# EAGLE design ESP_Testing_Adapter (EAGLE 8.6.0)
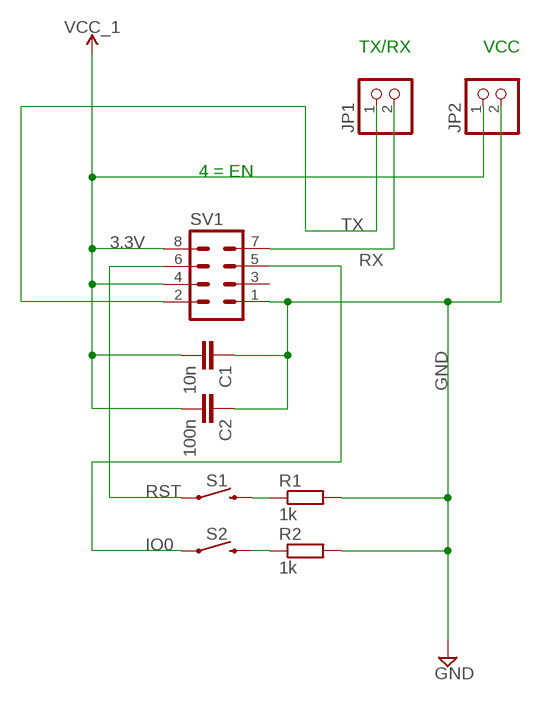
[diagram p0: schematic, sheet 1]

## Parts
C1  10n  C2.5/4  [C2.5-4]
C2  100n  C2.5/4  [C2.5-4]
JP1  PINHD-1X2  [1X02]
JP2  PINHD-1X2  [1X02]
R1  1k  R-EU_0207/7  [0207/7]
R2  1k  R-EU_0207/7  [0207/7]
S1  MOMENTARY-SWITCH-SPST-PTH-6.0MM  [TACTILE_SWITCH_PTH_6.0MM]
S2  MOMENTARY-SWITCH-SPST-PTH-6.0MM  [TACTILE_SWITCH_PTH_6.0MM]
SV1  MA04-2  [MA04-2]

## Nets
3.3V: C1.2 C2.2 JP2.1 SV1.4 SV1.8 ; supply symbol labelled VCC_1
GND: C1.1 C2.1 JP2.2 R1.2 R2.2 SV1.1
IO0: S2.1 SV1.5
N$1: R1.1 S1.3
N$3: R2.1 S2.3
RST: S1.1 SV1.6
RX: JP1.2 SV1.7
TX: JP1.1 SV1.2
Unconnected: SV1.3

## Notes on the sheet
- TX/RX | VCC
- 4 = EN

## Library data of the parts
C1 C2 = capacitor-wima:C: CAPACITOR naming: grid - package width
JP1 JP2 = pinhead:PINHD-1X2: PIN HEADER
R1 R2 = rcl:R-EU_: RESISTOR, European symbol; SPICEPREFIX: R
S1 S2 = SparkFun-Switches:MOMENTARY-SWITCH-SPST: Momentary Switch (Pushbutton) - SPST Normally-open (NO) SPST momentary switches (buttons, pushbuttons). Variants PTH-12MM - 12mm square, through-hole Momentary Pushbutton Switch - 12mm Square <https://www.sparkfun.com/products/9190> (COM-09190) PTH-6.0MM, PTH-6.0MM-KIT - 6.0mm square, through-hole Mini Pushbutton Switch <https://www.sparkfun.com/products/97> (COM-00097) KIT package intended for soldering kit's - only one side of pads' copper is exposed. PTH-RIGHT-ANGLE-KIT - Right-angle, through-hole Right Angle Tactile Button <https://www.sparkfun.com/products/10791> - Used on SparkFun BigTime Watch Kit <https://www.sparkfun.com/products/11734> SMD-12MM - 12mm square, surface-mount Tactile Button - SMD (12mm) <https://www.sparkfun.com/products/12993> (COM-12993) Used on SparkFun PicoBoard <https://www.sparkfun.com/products/11888> SMD-4.5MM - 4.5mm Square Trackball Switch Used on SparkFun Blackberry Trackballer Breakout <https://www.sparkfun.com/products/13169> SMD-4.6MMX2.8MM - 4.60mm x 2.80mm, surface mount Used on SparkFun SAMD21 Mini Breakout <https://www.sparkfun.com/products/13664> SMD-5.2MM, SMD-5.2-REDUNDANT - 5.2mm square, surface-mount Mini Pushbutton Switch - SMD <https://www.sparkfun.com/products/8720> (COM-08720) Used on Arduino Pro Mini <https://www.sparkfun.com/products/11114> REDUNDANT package connects both switch circuits together SMD-6.0X3.5MM - 6.0 x 3.5mm, surface mount Momentary Reset Switch SMD <https://www.sparkfun.com/products/8229> (COM-08229) SMD-6.2MM-TALL - 6.2mm square, surface mount Tactile Button - SMD (6mm) <https://www.sparkfun.com/products/12992> Used on SparkFun Digital Sandbox <https://www.sparkfun.com/products/12651> SMD-RIGHT-ANGLE - Right-angle, surface mount Used on SparkFun Block for Intel® Edison - Arduino <https://www.sparkfun.com/products/13036>; PROD_ID: SWCH-08441; SF_SKU: COM-00097
SV1 = con-lstb:MA04-2: PIN HEADER; OC_FARNELL: unknown; OC_NEWARK: unknown

## Board
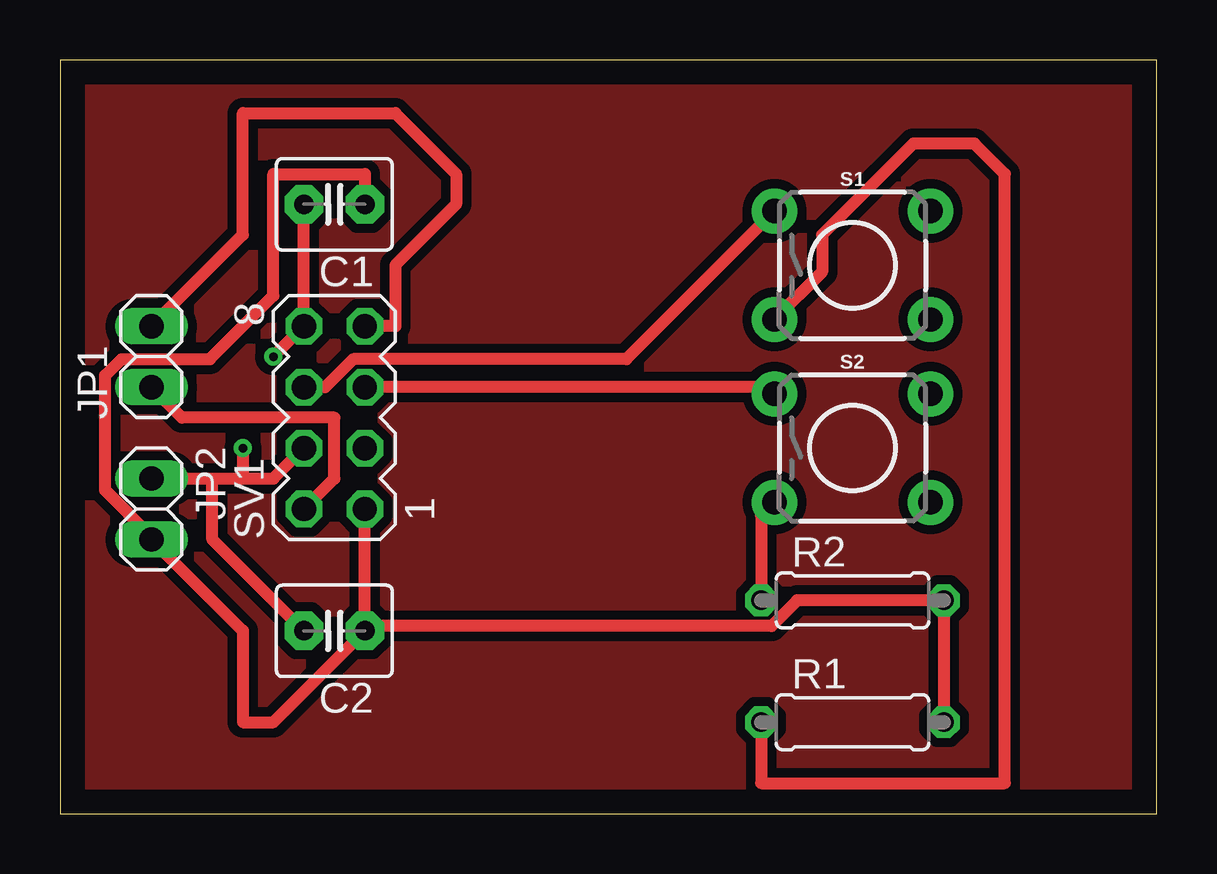
[diagram p1: board, top side]
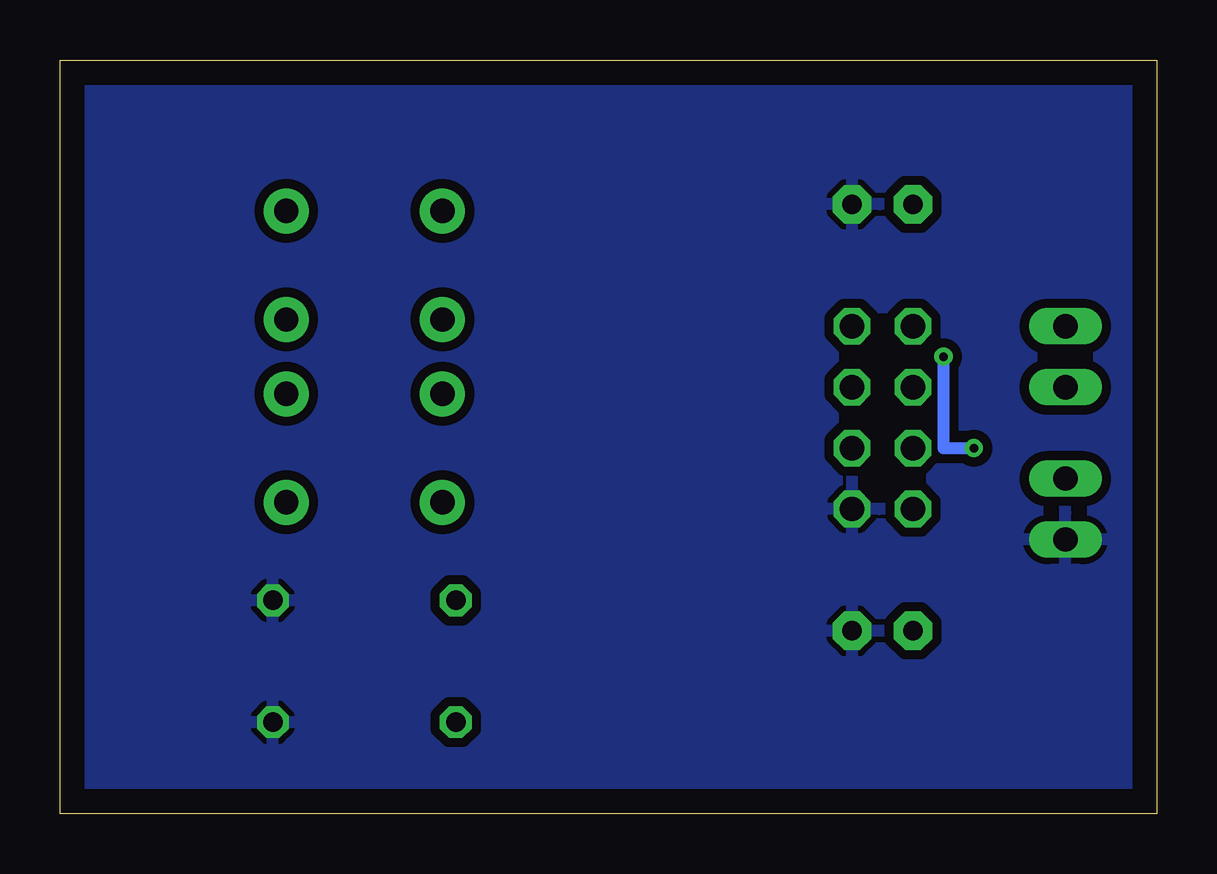
[diagram p2: board, bottom side, seen from below]

Size 45.7 x 31.42 mm. Coordinates in mm from the lower left corner, seen from the top.
Outline: 0,0 45.7,0 45.7,31.42 0,31.42 0,0
Copper layers (1*16): Top 0.035mm / dielectric 1.5mm / Bottom 0.035mm
Design rules "default *": minimum track width 6mil, minimum drill 0.35mm, track to track 15mil, track to pad 15mil, pad to pad 15mil, via to via 15mil, smd to smd 6mil, copper to edge 40mil, drill to drill 6mil, minimum pad ring 10mil, minimum via ring 8mil, stop-mask expansion 4mil, vias tented up to drill 0mil, thermal gap 10mil

### Footprints (pad centres in the part's own frame; a part is rotated, then mirrored left to right if it is on the bottom)
C2.5-4 = drill 0.813 pad 1.6 octagon: 1 -1.27,0; 2 1.27,0
1X02 = drill 1.016 long: 1 -1.27,0; 2 1.27,0
0207/7 = drill 0.813 octagon: 1 -3.81,0; 2 3.81,0
TACTILE_SWITCH_PTH_6.0MM = drill 1.016 pad 1.88: 1 -3.251,2.261; 2 3.251,2.261; 3 -3.251,-2.261; 4 3.251,-2.261
MA04-2 = drill 1.016 octagon: 1 -3.81,-1.27; 2 -3.81,1.27; 3 -1.27,-1.27; 4 -1.27,1.27; 5 1.27,-1.27; 6 1.27,1.27; 7 3.81,-1.27; 8 3.81,1.27

### Placement (x,y rotation side)
C1  11.43,25.4 180 top
C2  11.43,7.62 180 top
JP1  3.81,19.05 90 top
JP2  3.81,12.7 270 top
R1  33.02,3.81 0 top
R2  33.02,8.89 0 top
S1  33.02,22.86 0 top
S2  33.02,15.24 0 top
SV1  11.43,16.51 90 top

### Tracks (layer width: path | path; a pad name or v marks a point on that pad's centre or on a via)
3.3V  (via drill 0.35)
  Top 0.508: C1.2 SV1.8 v8.89,19.05 | JP2.1 6.35,13.97 | 6.35,13.97 7.62,13.97 | 7.62,13.97 8.89,13.97 SV1.4 | C2.2 6.35,11.43 6.35,13.97 | v7.62,15.24 7.62,13.97
  Bottom 0.508: v8.89,19.05 8.89,15.24 v7.62,15.24
GND
  Top 0.508: C2.1 SV1.1 | R1.2 R2.2 30.72,8.89 29.65,7.82 12.9,7.82 C2.1 | C1.1 12.7,26.67 8.89,26.67 8.89,21.59 6.25,18.95 2.56,18.95 1.88,18.26 1.88,13.49 3.81,11.56 JP2.2 7.62,7.62 7.62,3.81 8.89,3.81 C2.1
  pour Bottom: 0,31.75 0,0 45.72,0 45.72,31.75
IO0
  Top 0.508: S2.1 29.49,17.78 SV1.5
N$1
  Top 0.508: R1.1 29.21,1.27 39.37,1.27 39.37,26.67 38.1,27.94 35.56,27.94 31.75,24.13 31.75,22.58 S1.3
N$2
  pour Top: 0,31.75 45.72,31.75 45.72,0 0,0
N$3
  Top 0.508: S2.3 29.21,12.42 R2.1
RST
  Top 0.508: SV1.6 11.05,17.78 12.22,18.95 23.6,18.95 S1.1
RX
  Top 0.508: JP1.2 7.62,24.13 7.62,29.21 13.97,29.21 16.51,26.67 16.51,25.4 13.97,22.86 13.97,20.32 SV1.7
TX
  Top 0.508: SV1.2 11.43,13.97 11.43,16.51 5.08,16.51 JP1.1